# Altium schematic sheet Optical_Frontend.SchDoc
size A3; SheetNumber: 1; SheetTotal: 2
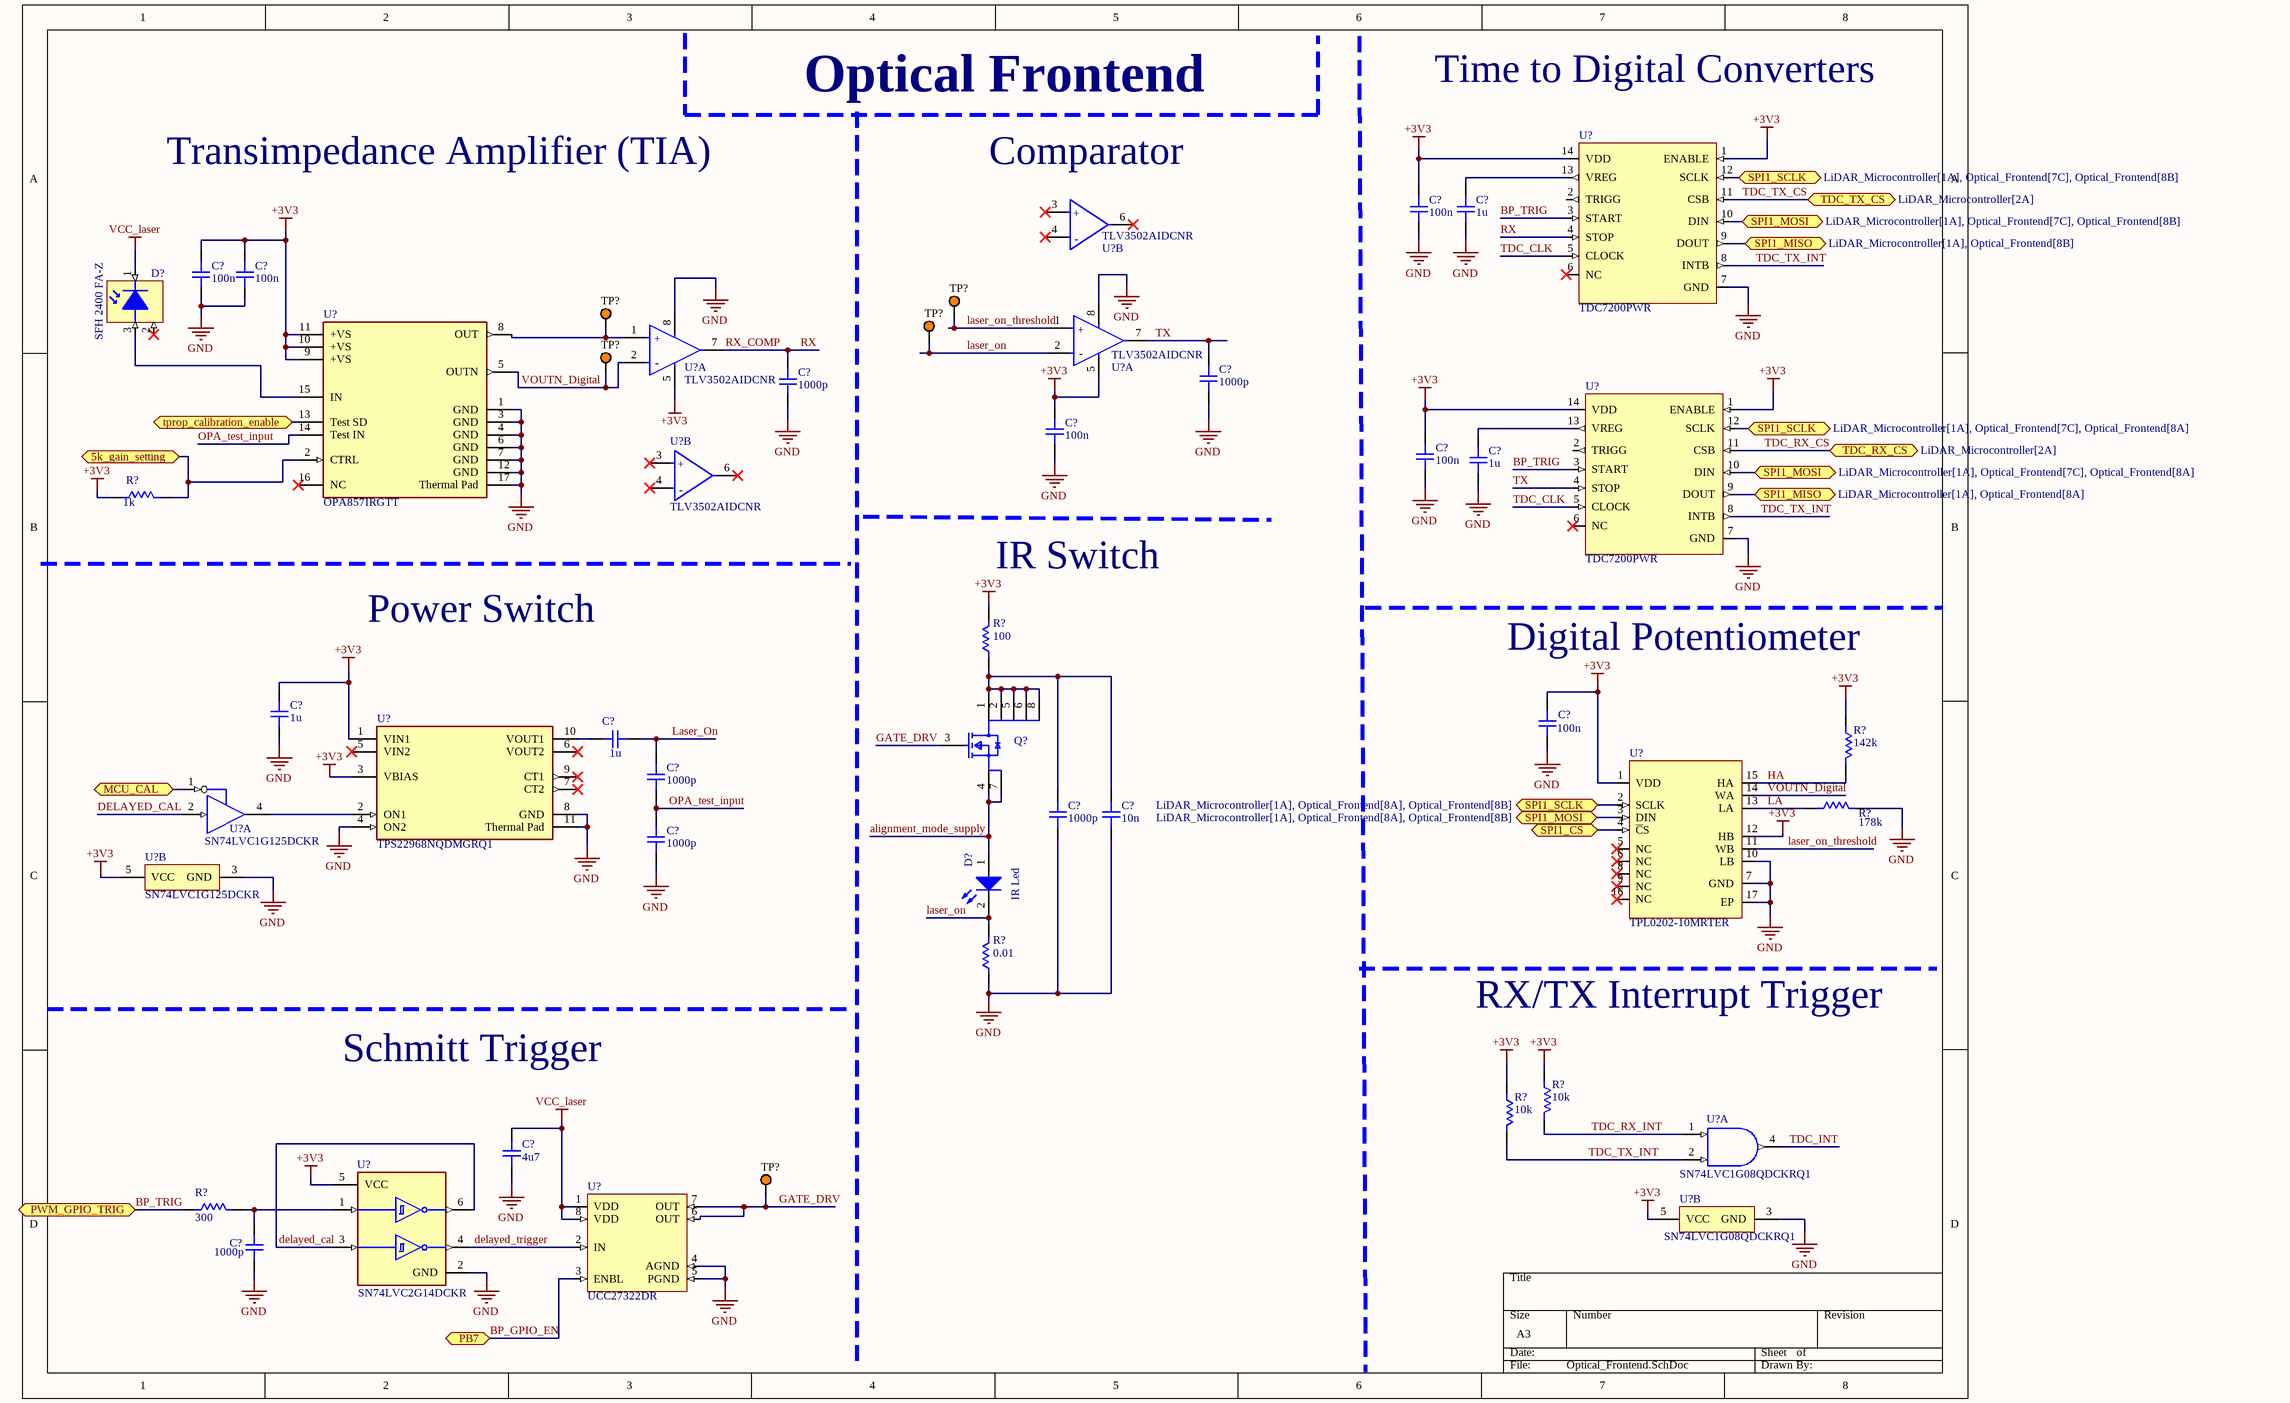
[diagram p0: Optical_Frontend.SchDoc]

## Parts
(Parts that share a designator on the sheet are numbered #1, #2 ... from top to bottom, then left to right.)
C?#1  100n  [CAP_0603]
C?#2  1u  [CAP_0603]
C?#3  100n  [CAP_0603]
C?#4  100n  [CAP_0603]
C?#5  1000p  [CAP_0603]
C?#6  1000p  [CAP_0603]
C?#7  100n  [CAP_0603]
C?#8  100n  [CAP_0603]
C?#9  1u  [CAP_0603]
C?#10  1u  [CAP_0603]
C?#11  100n  [CAP_0603]
C?#12  1u  [CAP_0603]
C?#13  1000p  [CAP_0603]
C?#14  1000p  [CAP_0603]
C?#15  10n  [CAP_0603]
C?#16  1000p  [CAP_0603]
C?#17  4u7  [CAP_0805]
C?#18  1000p  [CAP_0603]
D?#1  SFH 2400 FA-Z  [SFH 2400 FA-Z]
D?#2  IR Led  [WL-SITW_3528_L3.5W2.8H1.9]
Q?  CSD15571Q2  [FP-DQK0006C-MFG]  (value not drawn)
R?#1  1k  [RES_0603]
R?#2  100  [RES_0603]
R?#3  142k  [RES_0805]
R?#4  178k  [RES_0805]
R?#5  0.01  [RES_0805]
R?#6  10k  [RES_0603]
R?#7  10k  [RES_0603]
R?#8  300  [RES_0805]
TP?#1  5013  [KSTN-5013_V]  (value not drawn)
TP?#2  5013  [KSTN-5013_V]  (value not drawn)
TP?#3  5013  [KSTN-5013_V]  (value not drawn)
TP?#4  5013  [KSTN-5013_V]  (value not drawn)
TP?#5  5013  [KSTN-5013_V]  (value not drawn)
U?#1  TLV3502AIDCNR  [FP-DCN0008A-MFG]  (part B of 2)
U?#2  TDC7200PWR  [TDC7200PWR]
U?#3  OPA857IRGTT  [FP-RGT0016A-IPC_C]
U?#4  TLV3502AIDCNR  [FP-DCN0008A-MFG]  (part A of 2)
U?#5  TLV3502AIDCNR  [FP-DCN0008A-MFG]  (part A of 2)
U?#6  TLV3502AIDCNR  [FP-DCN0008A-MFG]  (part B of 2)
U?#7  TDC7200PWR  [TDC7200PWR]
U?#8  TPS22968NQDMGRQ1  [FP-DMG0010A-MFG]
U?#9  SN74LVC1G125DCKR  [DCK0005A_M]  (part A of 2)
U?#10  TPL0202-10MRTER  [TPL0202-10MRTER]
U?#11  SN74LVC1G125DCKR  [DCK0005A_M]  (part B of 2)
U?#12  SN74LVC1G08QDCKRQ1  [DCK0005A_M]  (part A of 2)
U?#13  SN74LVC2G14DCKR  [FP-DCK0006A-MFG]
U?#14  SN74LVC1G08QDCKRQ1  [DCK0005A_M]  (part B of 2)
U?#15  UCC27322DR  [UCC27614QDRQ1]

## Ports
5k_gain_setting (bidir), MCU_CAL (bidir), PB7 (bidir), PWM_GPIO_TRIG (bidir), SPI1_CS (bidir), SPI1_MISO (bidir, see LiDAR_Microcontroller[1A], Optical_Frontend[8A]), SPI1_MISO (bidir, see LiDAR_Microcontroller[1A], Optical_Frontend[8B]), SPI1_MOSI (bidir, see LiDAR_Microcontroller[1A], Optical_Frontend[7C], Optical_Frontend[8A]), SPI1_MOSI (bidir, see LiDAR_Microcontroller[1A], Optical_Frontend[7C], Optical_Frontend[8B]), SPI1_MOSI (bidir, see LiDAR_Microcontroller[1A], Optical_Frontend[8A], Optical_Frontend[8B]), SPI1_SCLK (bidir, see LiDAR_Microcontroller[1A], Optical_Frontend[7C], Optical_Frontend[8A]), SPI1_SCLK (bidir, see LiDAR_Microcontroller[1A], Optical_Frontend[7C], Optical_Frontend[8B]), SPI1_SCLK (bidir, see LiDAR_Microcontroller[1A], Optical_Frontend[8A], Optical_Frontend[8B]), TDC_RX_CS (bidir, see LiDAR_Microcontroller[2A]), TDC_TX_CS (bidir, see LiDAR_Microcontroller[2A]), tprop_calibration_enable (bidir)

## Nets
+3V3: C?#1.2 C?#3.2 C?#4.2 C?#7.2 C?#8.2 C?#10.2 C?#11.2 R?#1.1 R?#2.2 R?#3.2 R?#6.2 R?#7.2 U?#2.1(ENABLE) U?#2.14(VDD) U?#3.9(+VS) U?#3.10(+VS) U?#3.11(+VS) U?#4.5(V-) U?#5.5(V-) U?#7.1(ENABLE) U?#7.14(VDD) U?#8.1(VIN1) U?#8.3(VBIAS) U?#10.1(VDD) U?#10.12(HB) U?#11.5(VCC) U?#13.5(VCC) U?#14.5(VCC)
GND: C?#1.1 C?#2.1 C?#3.1 C?#4.1 C?#5.1 C?#6.1 C?#7.1 C?#8.1 C?#9.1 C?#10.1 C?#11.1 C?#14.1 C?#15.1 C?#16.1 C?#17.1 C?#18.1 R?#4.2 R?#5.1 U?#2.7(GND) U?#3.1(GND) U?#3.3(GND) U?#3.4(GND) U?#3.6(GND) U?#3.7(GND) U?#3.12(GND) U?#3.17(Thermal_Pad) U?#4.8(V+) U?#5.8(V+) U?#7.7(GND) U?#8.4(ON2) U?#8.8(GND) U?#8.11(Thermal_Pad) U?#10.7(GND) U?#10.10(LB) U?#10.17(EP) U?#11.3(GND) U?#13.2(GND) U?#14.3(GND) U?#15.4(AGND) U?#15.5(PGND)
VCC_laser: C?#17.2 D?#1.1(Cathode) U?#15.1(VDD) U?#15.8(VDD)
5k_gain_setting: R?#1.2 U?#3.2(CTRL) ; port 5k_gain_setting
alignment_mode_supply: D?#2.1(A) Q?.4(S) Q?.7(S)
BP_GPIO_EN: U?#15.3(ENBL) ; port PB7
BP_TRIG: R?#8.1 U?#2.3(START) U?#7.3(START) ; port PWM_GPIO_TRIG
DELAYED_CAL: U?#9.2(A) U?#13.3(2A) U?#13.6(1Y)
delayed_trigger: U?#13.4(2Y) U?#15.2(IN)
GATE_DRV: Q?.3(G) TP?#5.1 U?#15.6(OUT) U?#15.7(OUT)
HA: R?#3.1 U?#10.15(HA)
LA: R?#4.1 U?#10.13(LA)
Laser_On: C?#12.1 C?#13.2 D?#2.2(K) R?#5.2 TP?#3.1 U?#4.2(-IN_A)
laser_on_threshold: TP?#1.1 U?#4.1(+IN_A) U?#10.11(WB)
MCU_CAL: U?#9.1(~{OE}) ; port MCU_CAL
OPA_test_input: C?#13.1 C?#16.2 U?#3.14(Test_IN)
RX: C?#5.2 U?#2.4(STOP) U?#5.7(OUT_A)  [also labelled RX_COMP]
SPI1_CS: U?#10.4(~{C}S) ; port SPI1_CS
SPI1_MISO: U?#2.9(DOUT) U?#7.9(DOUT) ; port SPI1_MISO
SPI1_MOSI: U?#2.10(DIN) U?#7.10(DIN) U?#10.3(DIN) ; port SPI1_MOSI
SPI1_SCLK: U?#2.12(SCLK) U?#7.12(SCLK) U?#10.2(SCLK) ; port SPI1_SCLK
TDC_CLK: U?#2.5(CLOCK) U?#7.5(CLOCK)
TDC_INT: U?#12.4(Y)
TDC_RX_CS: U?#7.11(CSB) ; port TDC_RX_CS
TDC_RX_INT: R?#6.1 U?#12.1(A)
TDC_TX_CS: U?#2.11(CSB) ; port TDC_TX_CS
TDC_TX_INT: R?#7.1 U?#2.8(INTB) U?#7.8(INTB) U?#12.2(B)
tprop_calibration_enable: U?#3.13(Test_SD) ; port tprop_calibration_enable
TX: C?#6.2 U?#4.7(OUT_A) U?#7.4(STOP)
VOUTN_Digital: TP?#4.1 U?#3.5(OUTN) U?#5.2(-IN_A) U?#10.14(WA)
NetC?#2_2: C?#2.2 U?#2.13(VREG)
NetC?#9_2: C?#9.2 U?#7.13(VREG)
NetC?#12_2: C?#12.2 U?#8.10(VOUT1)
NetC?#14_2: C?#14.2 C?#15.2 Q?.1(D) Q?.2(D) Q?.5(D) Q?.6(D) Q?.8(D) R?#2.1
NetC?#18_2: C?#18.2 R?#8.2 U?#13.1(1A)
NetD?#1_3: D?#1.3(Anode) U?#3.15(IN)
NetTP?#2_1: TP?#2.1 U?#3.8(OUT) U?#5.1(+IN_A)
NetU?#8_2: U?#8.2(ON1) U?#9.4(Y)

Not connected (* = marked no-connect by the designer): D?#1 2(NC)*; U?#1 3(+IN_B)* 4(-IN_B)* 6(OUT_B)*; U?#2 2(TRIGG) 6(NC)*; U?#3 16(NC)*; U?#6 3(+IN_B)* 4(-IN_B)* 6(OUT_B)*; U?#7 2(TRIGG) 6(NC)*; U?#8 5(VIN2)* 6(VOUT2)* 7(CT2)* 9(CT1)*; U?#10 5(NC)* 6(NC)* 8(NC)* 9(NC)* 16(NC)*

## Notes on the sheet
- Optical Frontend
- Time to Digital Converters
- Transimpedance Amplifier (TIA)
- (near U?#1) Comparator
- (near R?#2) IR Switch
- Power Switch
- Digital Potentiometer
- RX/TX Interrupt Trigger
- Schmitt Trigger
- (in symbol CMP-04896-000006-1, part A) +; -
- (in symbol CMP-04896-000006-1, part B) +; -

## Library data of the parts
C?#1 C?#3 C?#4 C?#7 C?#8 C?#11 = MAJCH168BB7104KTEA01: Multilayer Ceramic Capacitors MLCC - SMD/SMT 100V 0.1uF 0603 X7R 10% AECQ2; Manufacturer: TAIYO YUDEN; Rating: 100nF 100V X7R 0603 10%; Manufacturer Part Number: MAJCH168BB7104KTEA01; Distributor Link: https://www.mouser.tw/en/ProductDetail/TAIYO-YUDEN/MAJCH168BB7104KTEA01?qs=ZcfC38r4PovaTBrG0IdezQ%3D%3D; Datasheet Link: https://www.mouser.com/catalog/specsheets/TAIYO_YUDEN_03-08-2024_MAJCH168BB7104KTEA01_SS.pdf?_gl=1*17qbpp1*_gcl_aw*R0NMLjE3ODUyMjg2NDkuQ2p3S0NBandwcUhUQmhBY0Vpd0FqMkFmdXJYOV9OUy1CV0xFSmd6T0FaYy1HZXR1bHVfaUZmaHVzRkI2bHhkODVUMjVSNlJWbnBOUkFob0NEdHNRQXZEX0J3RQ..*_gcl_au*MTM0NzYwMzc0Mi4xNzgyNDQ3MDMwLjE4MDQ0Nzg2ODUuMTc4NTI5MDg4OS4xNzg1MjkxOTE2LjE1NDk0Mzk5MTcuMTc4NTIxODYwOC4xNzg1MjkxOTE2*_ga*MTg5NTU5OTIyLjE3ODI0NDcwMzM.*_ga_15W4STQT4T*czE3ODUyODM3NTgkbzk5JGcxJHQxNzg1MjkxOTI1JGo0MiRsMCRoMA..; Dielectric: *
C?#2 C?#9 C?#10 C?#12 = C1608X7R2A105K080AC: MLCC - SMD/SMT Commercial Grade,MLCC,0603,X7R,100V,1uF,+/-10%,0.8mm; Manufacturer Name: TDK; ComponentLink1Description: Datasheet Link 1; ComponentLink1URL: https://product.tdk.com/system/files/dam/doc/product/capacitor/ceramic/mlcc/catalog/mlcc_commercial_general_en.pdf; Distributor Name: Mouser; ComponentLink2Description: Distributor Link 1; ComponentLink2URL: https://www.mouser.tw/zh/ProductDetail/TDK/C1608X7R2A105K080AC?qs=efUn273yAhc5BfjaNflQJg%3D%3D
C?#5 C?#6 C?#13 C?#14 C?#16 C?#18 = KAM15AR71H102KM: Multilayer Ceramic Capacitors MLCC - SMD/SMT 50V 1000pF X7R 0603 10% AEC-Q200; Manufacturer: KYOCERA AVX; Rating: 1nF 50V X7R 10%; Manufacturer Part Number: KAM15AR71H102KM; Distributor Link: https://www.mouser.tw/en/ProductDetail/KYOCERA-AVX/KAM15AR71H102KM?qs=OcgtsXO%252B3guc58RvGZLAWA%3D%3D; Datasheet Link: https://ele.kyocera.com/assets/products/capacitor/KGM_Series_e.pdf; Dielectric: *
C?#15 = KAF15AR71H103JM: Multilayer Ceramic Capacitors MLCC - SMD/SMT Automotive MLCC 0603, 10nF, 5%, X7R, 50VDC; Manufacturer: KYOCERA AVX; Rating: 10nF 50V X7R 0603 5%; Manufacturer Part Number: KAF15AR71H103JM; Distributor Link: https://www.mouser.tw/en/ProductDetail/KYOCERA-AVX/KAF15AR71H103JM?qs=sGAEpiMZZMvsSlwiRhF8qrQG6leidpLjNf3RmkJWfl3qRaUgdYaoYg%3D%3D; Datasheet Link: https://www.mouser.tw/datasheet/3/5926/1/AutoMLCCKAF.pdf; Dielectric: *
C?#17 = CGA4J1X7R1H475K125AC: Multilayer Ceramic Capacitors MLCC - SMD/SMT 0805 50VDC 4.7uF 10% AEC-Q200; Manufacturer: TDK; Rating: 4.7uF 50V X7R 10% 0805; Manufacturer Part Number: CGA4J1X7R1H475K125AC; Distributor Link: https://www.mouser.tw/en/ProductDetail/TDK/CGA4J1X7R1H475K125AC?qs=PqoDHHvF64%252BmskN2S82T2g%3D%3D; Datasheet Link: https://product.tdk.com/system/files/dam/doc/product/capacitor/ceramic/mlcc/catalog/mlcc_automotive_general_en.pdf?ref_disty=mouser; Dielectric: *
D?#1 = SFH 2400 FA-Z: Silicon PIN Photodiode, SMD; Manufacturer Name: ams OSRAM; ComponentLink1Description: Datasheet Link; ComponentLink1URL: https://www.mouser.com/datasheet/3/5912/1/SFH_2400_FA_EN.pdf; ComponentLink2Description: Distributor Link; ComponentLink2URL: https://www.mouser.com/en/ProductDetail/ams-OSRAM/SFH-2400-FA-Z?qs=K5ta8V%252BWhtYSGJkl7DYwdw%3D%3D; Manufacturer Part Number: SFH 2400 FA-Z
D?#2 = CMP-03913-90235593-3: WL-SITW SMT InfraRed TopLED Waterclear; Manufacturer Lifecycle Status: ACTIVE; Forward Voltage: 1.4V; Wavelength: 940nm; Max Reverse Voltage (DC): 5V; Viewing Angle: 120°; YEOL: 1 = Estimated lifetime > 10 years; Forward Current: 700mA; RoHS: Compliant; Max Operating Temperature: 85°C; Length: 3.2mm; Peak Wavelength: 940nm; Min Operating Temperature: -40°C; Width: 2.8mm; Height: 1.9mm; Lifecycle Status: Production; Packaging: Tape and Reel
Q? = CMP-04962-000051-1: MOSFET N-CH 20V 22A 6SON; Rds On Max: 15mR; Power Dissipation: 2.5W; Turn-Off Delay Time: 9.9ns; Number of Elements: 2; Number of Channels: 1; Turn-On Delay Time: 17.2ns; Input Capacitance: 419pF; Fall Time: 4.1ns; Drain to Source Resistance: 19.2mR; Element Configuration: Single; Contact Plating: Tin; Drain to Source Voltage (Vdss): 20V; Number of Pins: 6; Max Power Dissipation: 2.5W; Min Operating Temperature: -55°C; Max Operating Temperature: 150°C; Packaging: Tape and Reel; Rise Time: 17.2ns; Mount: Surface Mount; Gate to Source Voltage (Vgs): 20V; Drain to Source Breakdown Voltage: 20V; Lead Free: Lead Free; Continuous Drain Current (ID): 22A; Package Quantity: 3000
R?#1 = AC0603JR-071KL: Thick Film Resistors - SMD 1 kOhms 1/10 W 75 V 5% 0603 100 PPM / C - 55 C / + 155 C AEC-Q200; Manufacturer: YAGEO; Values: 1k 1/10W 5% 0603; Manufacturer Part Number: AC0603JR-071KL; Distributor Link: https://www.mouser.tw/en/ProductDetail/YAGEO/AC0603JR-071KL?qs=ygRr%2FtkhtetUuJMpTs3DCw%3D%3D; Datasheet Link: https://www.mouser.tw/datasheet/3/508/1/PYU_AC_51_ROHS_L.pdf
R?#2 = CRCW0603100RJNEBC: Thick Film Resistors - SMD 1/10Watt 100ohms 5% 0603 Commercial Use; Manufacturer: Vishay; Values: 100ohm 1/10W 5% 0603; Manufacturer Part Number: CRCW0603100RJNEBC; Distributor Link: https://www.mouser.tw/en/ProductDetail/YAGEO/RT0603WRE07100RL?qs=sGAEpiMZZMtlubZbdhIBIKm0gsRX2fVkkBVJnMJ1ydc%3D; Datasheet Link: https://www.vishay.com/docs/20035/dcrcwe3.pdf
R?#3 = TNPW0805142KBETA: Thin Film Resistors - SMD TNPW-0805 142K 0.1% T-9 RT1; Manufacturer: Vishay; Manufacturer Part Number: RT0805BRD07142KL; Ratings: 142 k, 0.1%, 0.125 W, 0805; Distributor Link: https://www.mouser.com/en/ProductDetail/Vishay/TNPW0805142KBETA?qs=vmHwEFxEFR87BNEIEEmbQw%3D%3D
R?#4 = RT0805BRD07178KL: Thin Film Resistors - SMD 1/8W 178K ohm .1% 25ppm; Manufacturer: Yageo America; Ratings: 178 k, 0.1%, 0.125 W, 0805; Manufacturer Part Number: RT0805BRD07178KL; Distributor Link: https://www.mouser.com/en/ProductDetail/YAGEO/RT0805BRD07178KL?qs=TvbiuNL4H84pel0CAYOXAQ%3D%3D; ComponentLink1Description: Datasheet Link; ComponentLink1URL: https://www.mouser.com/datasheet/3/72/1/PYU_RT_1_TO_0_01_ROHS_L.pdf
R?#5 = WSL0805R0100FEA18: Current Sense Resistors - SMD 1/4watt .01ohms 1%; Manufacturer: Yageo America; Ratings: 0.01, 1%, 0.25 W, 0805; Manufacturer Part Number: WSL0805R0100FEA18; Distributor Link: https://www.mouser.com/en/ProductDetail/Vishay-Dale/WSL0805R0100FEA18?qs=fncU5wK7Cm%252BOEp0dgHdc7A%3D%3D; ComponentLink1Description: Datasheet Link; ComponentLink1URL: https://www.vishay.com/doc?31057
R?#6 R?#7 = CRCW060310K0FKEI: Thick Film Resistors - SMD 10K OHM 1%; Manufacturer: Vishay; Value: 10k 1% 1/8W 0603; Manufacturer Part Number: CRCW060310K0FKEI; Distributor Link: https://www.vishay.com/docs/20035/dcrcwe3.pdf
R?#8 = ERJ-6GEYJ301V: Thick Film Resistors - SMD 0805 300ohms 5% AEC-Q200 / RES, 300, 5%, 0.125 W, 0805; Manufacturer: Panasonic; Manufacturer Part Number: ERJ-6GEYJ301V; Distributor Link: https://www.mouser.com/en/ProductDetail/Panasonic-Industry/ERJ-6GEYJ301V?qs=tQNqqtTOejJLN%2FpK89Mq5w%3D%3D; Datasheet Link: https://industrial.panasonic.com/cdbs/www-data/pdf/RDO0000/RDO0000C334.pdf; Ratings: 300, 5%, 0.125 W, 0805
TP?#1-TP?#5 = CMP-1672-00005-4: Test Point, Orange, Through Hole, RoHS, Bulk; Manufacturer: Keystone; REACH SVHC: No SVHC; ComponentLink2Description: Datasheet; PackageDescription: 1-Pin Through Hole Device, Dia 3.17 mm; Package Quantity: 100; PackageReference: 5013; Contact Material: Bronze; DatasheetVersion: Rev. F, 12/2013; ComponentLink2URL: http://www.keyelco.com/product-pdf.cfm?p=1322; Contact Plating: Silver; ComponentLink1URL: http://www.keyelco.com/; Packaging: Bulk; ComponentLink1Description: Manufacturer URL; Colour: Orange; Height: 8.12 mm; RoHSCompliant: True; Mount: Through Hole; Mounting Technology: Through Hole
U?#1 U?#4-U?#6 = CMP-04896-000006-1: IC COMPARATOR R-R HI-SPD SOT23-8; Manufacturer: Texas Instruments; Standoff Height: 0mm; Number Of Channels: 2; Input Bias Current: 0.000002uA; Max Dual Supply Voltage: 2.75V; Max Supply Voltage: 5.5V; Min Dual Supply Voltage: 1.35V; Min Supply Voltage: 2.7V; Nominal Supply Current: 3.2mA; Input Offset Voltage: 1mV; Max Junction Temp: +150°C; Ambient Temperature Range Low: -40°C; Ambient Temperature Range High: +125°C; Temperature Range High: +125°C; Mouser Description: Analog Comparators 4.5ns Rail-to-Rail Comparator; RoHS: TRUE; Temperature: -40°C to +125°C; Manufacturer Part Number: TLV3502AIDCNR; ComponentLink2Description: Datasheet; Lead Free: Yes; Package: DCN0008A; Device Class L2: Linear ICs; Octopart: https://octopart.com/tlv3502aidcnr-texas+instruments-841436; Height: 1.45mm; Digikey Description: IC COMPARATOR R-R HI-SPD SOT23-8; Device Class L1: Integrated Circuits (ICs); ComponentLink2URL: http://www.ti.com/lit/ds/symlink/tlv3502.pdf; Temperature Range Low: -40°C; Automotive: No; Category: IC; Device Class L3: Comparators
U?#2 U?#7 = TDC7200PWR: Sensor Interface Time-to-digital conv erter for time-of-f A 595-TDC7200PW; Manufacturer Name: Texas Instruments; ComponentLink1Description: Datasheet Link; ComponentLink1URL: https://www.ti.com/lit/gpn/tdc7200; ComponentLink2Description: Distributor Link; ComponentLink2URL: https://www.mouser.tw/en/ProductDetail/Texas-Instruments/TDC7200PWR?qs=Q2snjRlG%2FBJNiMilyUsr3A%3D%3D
U?#3 = CMP-04895-000324-1: IC OPAMP GP 1 CIRCUIT 16VQFN; Min Supply Voltage: 2.6V; Number of Channels: 1; Output Current per Channel: 50mA; Slew Rate: 220V/µs; Operating Supply Current: 23.4mA; Max Supply Voltage: 3.6V; Gain Bandwidth Product: 6.8GHz; -3db Bandwidth: 130MHz; Input Bias Current: 1uA; REACH SVHC: No SVHC; Number of Pins: 16; Min Operating Temperature: -40°C; Mount: Surface Mount; Number of Circuits: 1; Max Operating Temperature: 95°C; Packaging: Cut Tape; Max Input Current: 23.4mA; RoHS Compliant: Yes; Lead Free: Lead Free; Case/Package: QFN
U?#8 = CMP-04910-000102-1: IC PWR SWITCH N-CHAN 1:1 10WSON; Output Configuration: High Side; Interface: On/Off; Number of Outputs: 2; Max Output Current: 4A; Lead Free: Lead Free; Max Operating Temperature: 125°C; Min Operating Temperature: -40°C; RoHS Compliant: Yes; Packaging: Tape and Reel; Number of Channels: 2
U?#9 U?#11 = CMP-0859-00281-3: Single Bus Buffer Gate With 3-State Outputs, DCK0005A, LARGE T&R; Manufacturer: Texas Instruments; Bits(#): 1; tpd @ Nom Voltage(Max)(ns): 9,5.5,4.5,4; 3-State Output: Yes; Output Type: CMOS; Sub-Family: Non-Inverting Buffer/Driver; Logic: True; Output Drive (IOL/IOH)(Max)(mA): 32/-32; Voltage(Nom)(V): 1.8,2.5,3.3,5; ICC @ Nom Voltage(Max)(mA): 0.01; Technology Family: LVC; VCC(Min)(V): 1.65; VCC(Max)(V): 5.5; F @ Nom Voltage(Max)(Mhz): 150; Rating: Catalog; Input Type: CMOS/TTL; Schmitt Trigger: No; PackageReference: DCK0005A; Generic Part Number: SN74LVC1G125; DatasheetVersion: SCES223T; Operating Temperature Range(C): -40 to 125,-40 to 85
U?#10 = TPL0202-10MRTER: TPL0202 256-Taps Dual Channel Digital Potentiometer With SPI and Non-Volatile Memory; Manufacturer Name: Texas Instruments; ComponentLink1Description: Datasheet Link; ComponentLink1URL: https://www.ti.com/lit/ds/symlink/tpl0202-10.pdf?ts=1786782222055; ComponentLink2Description: Distributor Link; ComponentLink2URL: https://www.mouser.tw/en/ProductDetail/Texas-Instruments/TPL0202-10MRTER?qs=O1HRStiETCjiIaUc6hg4xg%3D%3D
U?#12 U?#14 = CMP-0859-00272-3: Automotive Catalog Single 2-Input Positive-AND Gate, DCK0005A, LARGE T&R; Manufacturer: Texas Instruments; Generic Part Number: SN74LVC1G08-Q1; Bits(#): 1; VCC(Min)(V): 1.65; Output Drive (IOL/IOH)(Max)(mA): 32/-32; Output Type: CMOS; Input Type: CMOS/TTL; Schmitt Trigger: No; ICC @ Nom Voltage(Max)(mA): 0.01; Technology Family: LVC; tpd @ Nom Voltage(Max)(ns): 8,5.5,4.5,4; Voltage(Nom)(V): 1.8,2.5,3.3,5; F @ Nom Voltage(Max)(Mhz): 150; VCC(Max)(V): 5.5; Gate Type: AND; Logic: True; PackageReference: DCK0005A; Rating: Automotive; DatasheetVersion: SCES556F; 3-State Output: No; Operating Temperature Range(C): -40 to 125,-40 to 85; Sub-Family: AND Gate
U?#13 = CMP-0859-00454-5: IC INVERTER SCHMITT 2CH SC70-6; Logic Function: Inverting; Max Supply Voltage: 5.5V; Propagation Delay: 9.5ns; Number of Elements: 2; Max Output Current: 32mA; High Level Output Current: -32mA; Min Supply Voltage: 1.65V; Number of Inputs: 1; Quiescent Current: 10uA; Radiation Hardening: No; Max Operating Temperature: 125°C; Packaging: Tape and Reel; Termination: SMD/SMT; Lead Free: Lead Free; RoHS Compliant: Yes; Contact Plating: Gold; Number of Bits: 2; Turn-On Delay Time: 9.5ns; Output Current: 32mA; Number of Circuits: 2; Mount: Surface Mount; Case/Package: SC; Low Level Output Current: 32mA; REACH SVHC: No SVHC; Number of Pins: 6; Package Quantity: 3000; Min Operating Temperature: -40°C; Number of Gates: 2; Weight: 8.8E-05oz
U?#15 = UCC27322DR: UCC2732x-Q1 Single 9-A High-Speed Low-Side MOSFET Driver With Enable; Manufacutrer Name: Texas Instruments; ComponentLink1Description: Distributor Link; ComponentLink1URL: https://www.mouser.com/en/ProductDetail/Texas-Instruments/UCC27322DR?qs=eJkN62t4xTW8JcQ%2FxDY%252BbQ%3D%3D&srsltid=AfmBOorF5uMu5K5oJ2uwjCfS-ChVb6PP3sk642Xibnc5-HeBSVreE6oL; ComponentLink2Description: Datasheet Link; ComponentLink2URL: https://www.ti.com/lit/gpn/ucc27321